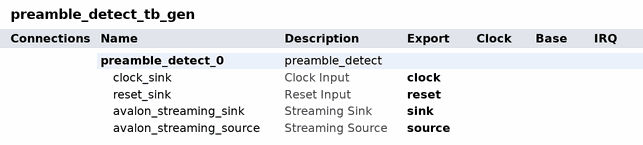
[diagram p0: system contents]
# Platform Designer (Qsys) system preamble_detect_tb_gen, MAX 10 10M16SAU169C8G
# Parameters at their usual value, and those the tool derives, are not listed.
package require qsys
create_system preamble_detect_tb_gen
set_project_property DEVICE_FAMILY {MAX 10}
set_project_property DEVICE 10M16SAU169C8G

add_instance preamble_detect_0 preamble_detect 1.0

# exported interfaces
add_interface clock clock sink
set_interface_property clock EXPORT_OF preamble_detect_0.clock_sink
add_interface reset reset sink
set_interface_property reset EXPORT_OF preamble_detect_0.reset_sink
add_interface sink avalon_streaming sink
set_interface_property sink EXPORT_OF preamble_detect_0.avalon_streaming_sink
add_interface source avalon_streaming source
set_interface_property source EXPORT_OF preamble_detect_0.avalon_streaming_source

set_interconnect_requirement {$system} qsys_mm.clockCrossingAdapter HANDSHAKE
set_interconnect_requirement {$system} qsys_mm.enableEccProtection FALSE
set_interconnect_requirement {$system} qsys_mm.insertDefaultSlave FALSE
set_interconnect_requirement {$system} qsys_mm.maxAdditionalLatency 1

save_system preamble_detect_tb_gen.qsys
